# Altium project AS5600.PrjPcb
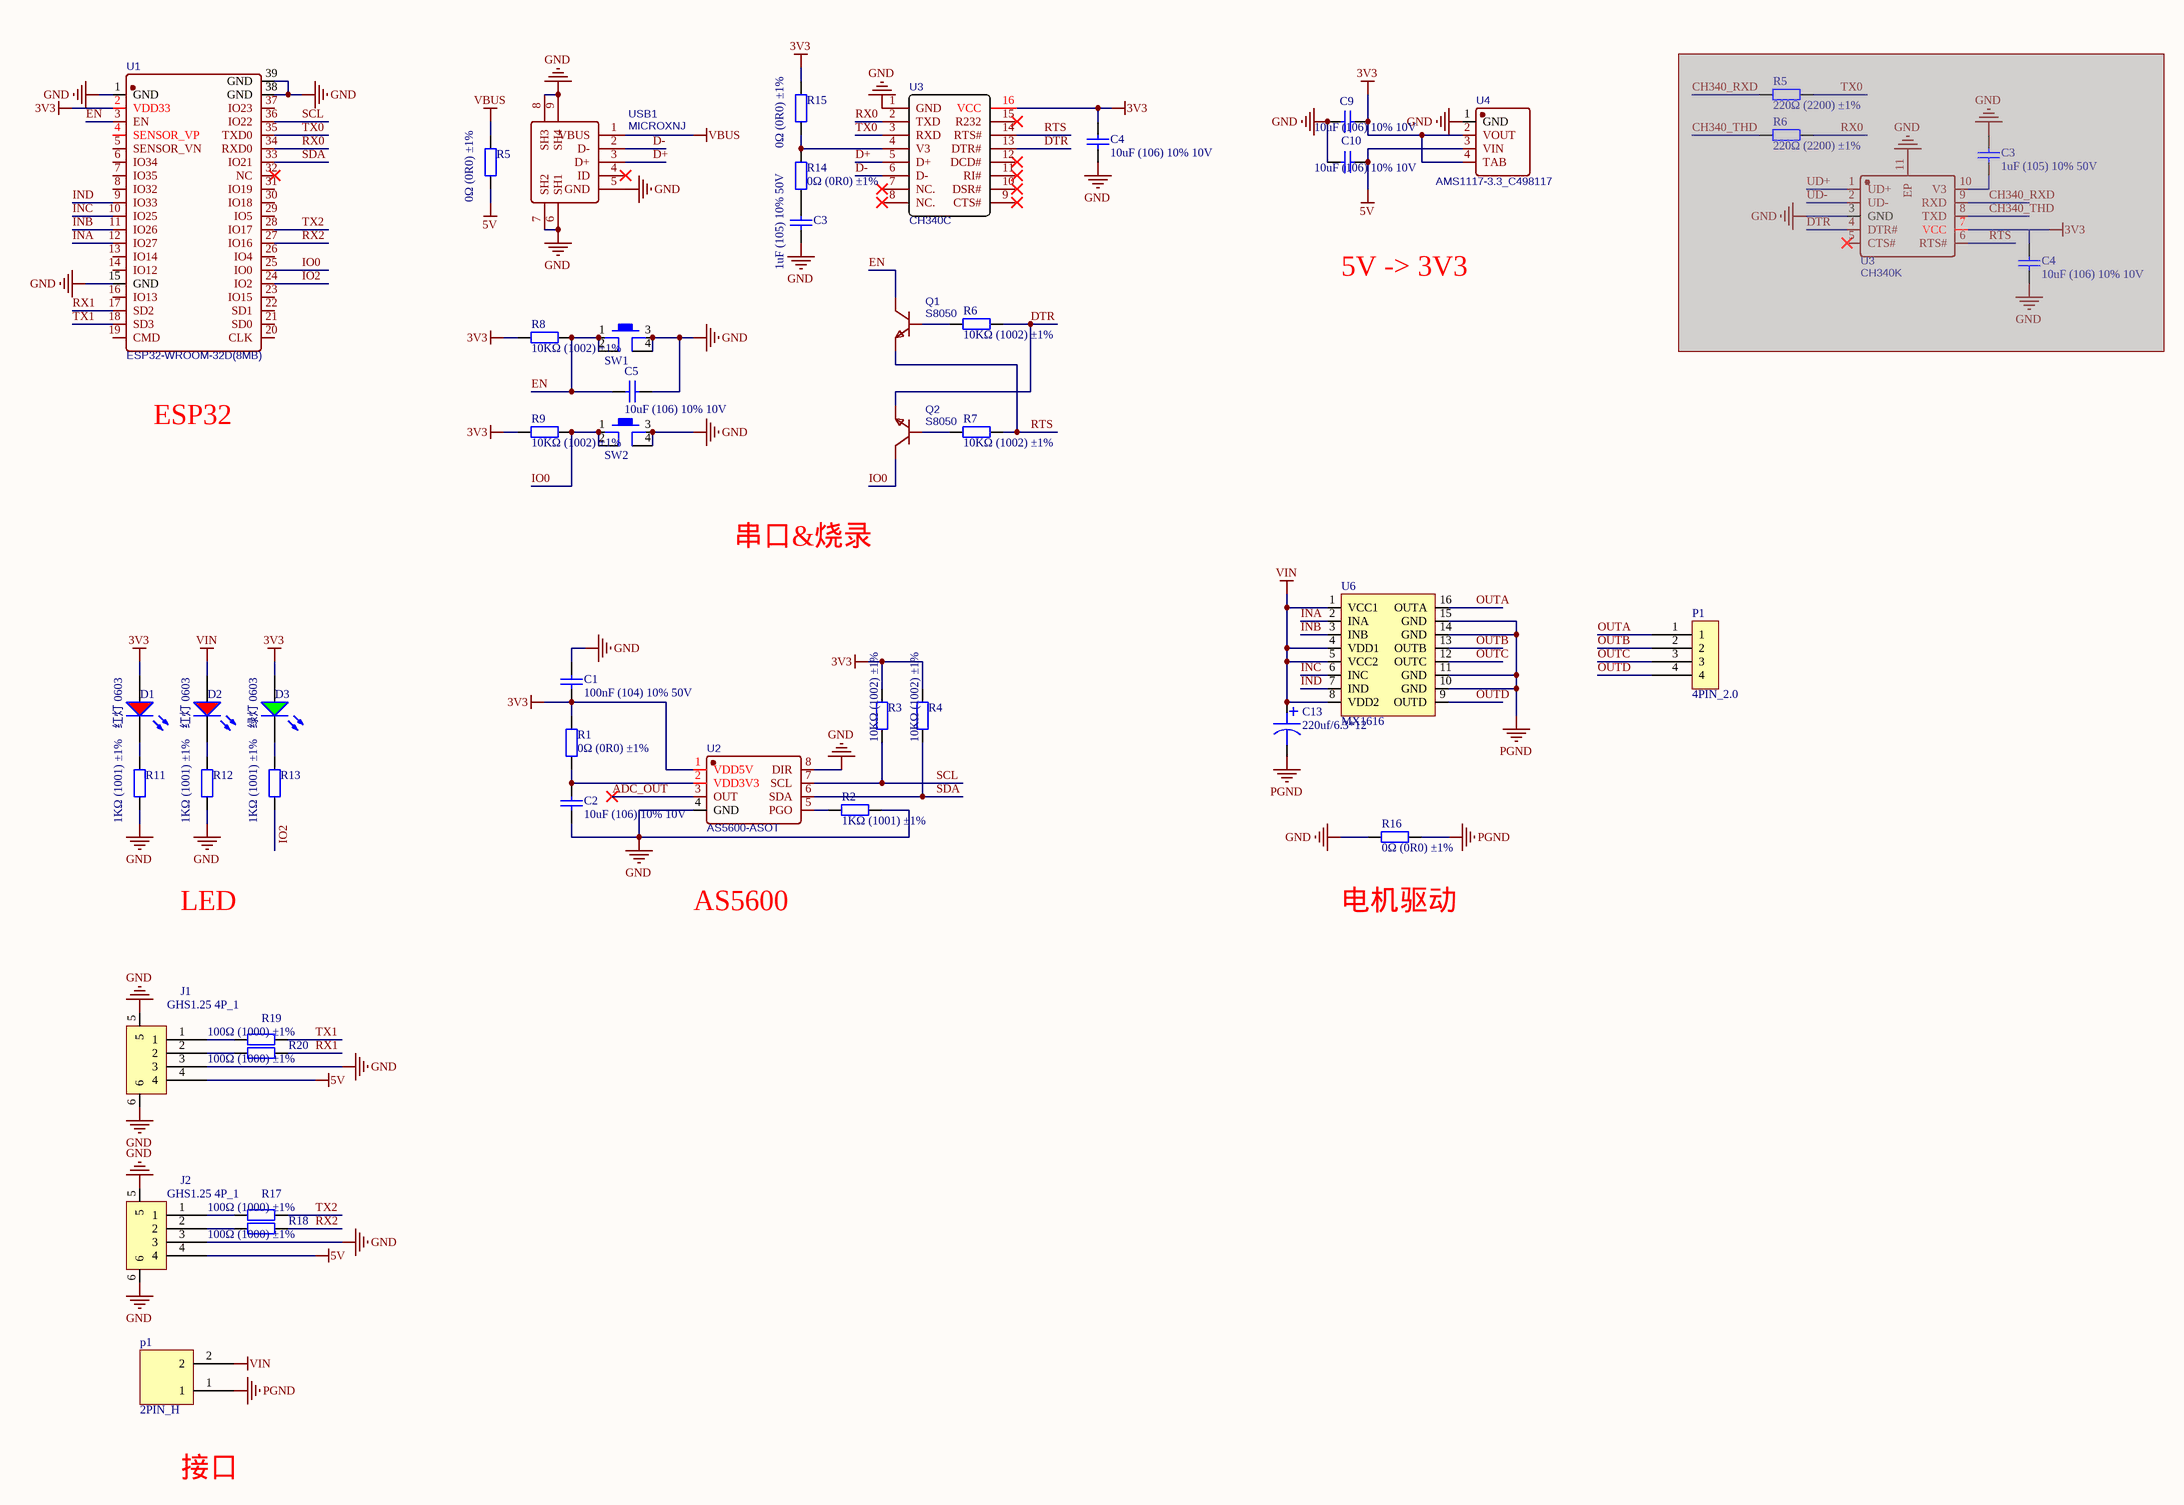
[diagram p0: AS5600.SchDoc]
1 sheet, 49 parts. Net scope: global (net labels, ports and power ports of the same name join across sheets).
Board file: AS5600.PcbDoc

## Sheet AS5600.SchDoc
size A2

### Parts
(Parts that share a designator on the sheet are numbered #1, #2 ... from top to bottom, then left to right.)
C1  100nF (104) 10% 50V  [0603_C]
C2  10uF (106) 10% 10V  [0603_C]
C3#1  1uF (105) 10% 50V  [0603_C]  (masked out: inside a compile mask, not in the netlist)
C3#2  1uF (105) 10% 50V  [0603_C]
C4#1  10uF (106) 10% 10V  [0603_C]
C4#2  10uF (106) 10% 10V  [0603_C]  (masked out: inside a compile mask, not in the netlist)
C5  10uF (106) 10% 10V  [0603_C]
C9  10uF (106) 10% 10V  [0603_C]
C10  10uF (106) 10% 10V  [0603_C]
C13  220uf/6.3*12  [220UF_25V]
D1  红灯 0603  [0603_LED_S1]
D2  红灯 0603  [0603_LED_S1]
D3  绿灯 0603  [0603_LED_S1]
J1  GHS1.25 4P_1  [SM04B-GHS卧式]
J2  GHS1.25 4P_1  [SM04B-GHS卧式]
P1#1  4PIN_2.0  [4PIN_2MM]
p1#2  2PIN_H  [CONN-TH_XH-2A]
Q1  S8050  [S8050]
Q2  S8050  [S8050]
R1  0Ω (0R0) ±1%  [0603_R]
R2  1KΩ (1001) ±1%  [0603_R]
R3  10KΩ (1002) ±1%  [0603_R]
R4  10KΩ (1002) ±1%  [0603_R]
R5#1  220Ω (2200) ±1%  [0603_R]  (masked out: inside a compile mask, not in the netlist)
R5#2  0Ω (0R0) ±1%  [0603_R]
R6#1  220Ω (2200) ±1%  [0603_R]  (masked out: inside a compile mask, not in the netlist)
R6#2  10KΩ (1002) ±1%  [0603_R]
R7  10KΩ (1002) ±1%  [0603_R]
R8  10KΩ (1002) ±1%  [0603_R]
R9  10KΩ (1002) ±1%  [0603_R]
R11  1KΩ (1001) ±1%  [0603_R]
R12  1KΩ (1001) ±1%  [0603_R]
R13  1KΩ (1001) ±1%  [0603_R]
R14  0Ω (0R0) ±1%  [0603_R]
R15  0Ω (0R0) ±1%  [0603_R]
R16  0Ω (0R0) ±1%  [0603_R]
R17  100Ω (1000) ±1%  [0603_R]
R18  100Ω (1000) ±1%  [0603_R]
R19  100Ω (1000) ±1%  [0603_R]
R20  100Ω (1000) ±1%  [0603_R]
SW1  按键开关  [SW_SMD_4P_2]  (value not drawn)
SW2  按键开关  [SW_SMD_4P_2]  (value not drawn)
U1  ESP32-WROOM-32D(8MB)  [ESP-WROOM-32D]
U2  AS5600-ASOT  [AS5600-ASOT]
U3#1  CH340C  [CH340C]
U3#2  CH340K  [CH340K]  (masked out: inside a compile mask, not in the netlist)
U4  AMS1117-3.3_C498117  [PG-SOT223-4_L6.5-W3.5-P2.30-LS7.0-BR]
U6  MX1616  [MX1616]
USB1  MICROXNJ  [MICRO-USB-SMD_MICROXNJ]

### Nets
3V3: C1.1 C4#1.2 C9.2 D1.A D3.A R1.2 R3.2 R4.2 R8.1 R9.1 R15.1 U1.2(VDD33) U2.1(VDD5V) U3#1.16(VCC) U4.2(VOUT) U4.4(TAB)
5V: C10.2 J1.4 J2.4 R5#2.2 U4.3(VIN)
GND: C1.2 C2.1 C3#2.1 C4#1.1 C5.2 C9.1 C10.1 J1.3 J1.5 J1.6 J2.3 J2.5 J2.6 R2.2 R11.2 R12.2 R16.1 SW1.3 SW1.4 SW2.3 SW2.4 U1.1(GND) U1.15(GND) U1.38(GND) U1.39(GND) U2.4(GND) U2.8(DIR) U3#1.1(GND) U4.1(GND) USB1.5(GND) USB1.6(SH1) USB1.7(SH2) USB1.8(SH3) USB1.9(SH4)
PGND: C13.2 p1#2.1 R16.2 U6.10(GND) U6.11(GND) U6.14(GND) U6.15(GND)
VBUS: R5#2.1 USB1.1(VBUS)
VIN: C13.1 D2.A p1#2.2 U6.1(VCC1) U6.4(VDD1) U6.5(VCC2) U6.8(VDD2)
ADC_OUT: U2.3(OUT)
D+: U3#1.5(D+) USB1.3(D+)
D-: U3#1.6(D-) USB1.2(D-)
DTR: Q2.2(E) R6#2.2 U3#1.13(DTR#)
EN: C5.1 Q1.3(C) R8.2 SW1.1 SW1.2 U1.3(EN)
INA: U1.12(IO27) U6.2(INA)
INB: U1.11(IO26) U6.3(INB)
INC: U1.10(IO25) U6.6(INC)
IND: U1.9(IO33) U6.7(IND)
IO0: Q2.3(C) R9.2 SW2.1 SW2.2 U1.25(IO0)
IO2: R13.2 U1.24(IO2)
OUTA: P1#1.1 U6.16(OUTA)
OUTB: P1#1.2 U6.13(OUTB)
OUTC: P1#1.3 U6.12(OUTC)
OUTD: P1#1.4 U6.9(OUTD)
RTS: Q1.2(E) R7.2 U3#1.14(RTS#)
RX0: U1.34(RXD0) U3#1.2(TXD)
RX1: R20.2 U1.17(SD2)
RX2: R18.2 U1.27(IO16)
SCL: R3.1 U1.36(IO22) U2.7(SCL)
SDA: R4.1 U1.33(IO21) U2.6(SDA)
TX0: U1.35(TXD0) U3#1.3(RXD)
TX1: R19.2 U1.18(SD3)
TX2: R17.2 U1.28(IO17)
NetC2_2: C2.2 R1.1 U2.2(VDD3V3)
NetC3#2_2: C3#2.2 R14.2
NetD1_K: D1.K R11.1
NetD2_K: D2.K R12.1
NetD3_K: D3.K R13.1
NetJ1_1: J1.1 R19.1
NetJ1_2: J1.2 R20.1
NetJ2_1: J2.1 R17.1
NetJ2_2: J2.2 R18.1
NetQ1_1: Q1.1(B) R6#2.1
NetQ2_1: Q2.1(B) R7.1
NetR2_1: R2.1 U2.5(PGO)
NetR14_1: R14.1 R15.2 U3#1.4(V3)

Not connected (* = marked no-connect by the designer): U1 4(SENSOR_VP) 5(SENSOR_VN) 6(IO34) 7(IO35) 8(IO32) 13(IO14) 14(IO12) 16(IO13) 19(CMD) 20(CLK) 21(SD0) 22(SD1) 23(IO15) 26(IO4) 29(IO5) 30(IO18) 31(IO19) 32(NC)* 37(IO23); U3#1 7(NC.)* 8(NC.)* 9(CTS#)* 10(DSR#)* 11(RI#)* 12(DCD#)* 15(R232)*; USB1 4(ID)*

### Notes on the sheet
- 5V -> 3V3
- ESP32
- 串口&烧录
- LED
- AS5600
- (near R16) 电机驱动
- 接口

### Library data of the parts
C1 = 0603 100nF (104) 10% 50V: 贴片电容; ComponentLink1Description: 供应商链接; ComponentLink1URL: http://www.szlcsc.com/product/details_15331.html; Package: 0603; Supplier: LC; SuppliersPartNumber: C14663
C2 C4#1 C4#2 C5 C9 C10 = 0603 10uF (106) 10% 10V: 贴片电容; ComponentLink1Description: 供应商链接; ComponentLink1URL: http://www.szlcsc.com/product/details_20411.html; Package: 0603; Supplier: LC; SuppliersPartNumber: C19702
C3#1 C3#2 = 0603 1uF (105) 10% 50V: 贴片电容; ComponentLink1Description: 供应商链接; ComponentLink1URL: http://www.szlcsc.com/product/details_16531.html; Package: 0603; Supplier: LC; SuppliersPartNumber: C15849
C13 = 220uf 25Vv
D1 D2 = 0603 红灯: 发光二极管; ComponentLink1Description: 供应商链接; ComponentLink1URL: http://www.szlcsc.com/product/details_2659.html; Package: 0603; Supplier: LC; SuppliersPartNumber: C2286
D3 = 0603 绿灯: 发光二极管; ComponentLink1Description: 供应商链接; ComponentLink1URL: http://www.szlcsc.com/product/details_73152.html; Package: 0603; Supplier: LC; SuppliersPartNumber: C72043
J1 J2 = GHS1.25 4P_1: 卧式
Q1 Q2 = S8050_C2894711: BOM_Manufacturer: PUOLOP(迪浦); Contributor: LCSC; BOM_Supplier: LCSC; BOM_Supplier Part: C2894711; BOM_Manufacturer Part: S8050; spicePre: Q; spiceSymbolName: S8050_C2894711
R1 R5#2 R14-R16 = 0603 0Ω (0R0) 1%: 贴片电阻; ComponentLink1Description: 供应商链接; ComponentLink1URL: http://www.szlcsc.com/product/details_21903.html; Package: 0603; Supplier: LC; SuppliersPartNumber: C21189
R2 R11-R13 = 0603 1KΩ (1001) 1%: 贴片电阻; ComponentLink1Description: 供应商链接; ComponentLink1URL: http://www.szlcsc.com/product/details_21904.html; Package: 0603; Supplier: LC; SuppliersPartNumber: C21190
R3 R4 R6#2 R7-R9 = 0603 10KΩ (1002) 1%: 贴片电阻; ComponentLink1Description: 供应商链接; ComponentLink1URL: http://www.szlcsc.com/product/details_26547.html; Package: 0603; Supplier: LC; SuppliersPartNumber: C25804
R5#1 R6#1 = 0603 220Ω (2200) 1%: 贴片电阻; ComponentLink1Description: 供应商链接; ComponentLink1URL: http://www.szlcsc.com/product/details_23689.html; Package: 0603; Supplier: LC; SuppliersPartNumber: C22962
R17-R20 = 0603 100Ω (1000) 1%: 贴片电阻; ComponentLink1Description: 供应商链接; ComponentLink1URL: http://www.szlcsc.com/product/details_23502.html; Package: 0603; Supplier: LC; SuppliersPartNumber: C22775
SW1 SW2 = SW_SMD_4P
U1 = ESP32-WROOM-32D(8MB): BOM_Manufacturer: Espressif Systems; Contributor: LCSC; BOM_Supplier: LCSC; BOM_Supplier Part: C529577; BOM_Manufacturer Part: ESP32-WROOM-32D(8MB); BOM_JLCPCB Part Class: Extended Part; spicePre: U; spiceSymbolName: ESP32-WROOM-32D(8MB)
U2 = AS5600-ASOT: BOM_Manufacturer: Advanced Monolithic Systems; Contributor: LCSC; BOM_Supplier: LCSC; BOM_Supplier Part: C499458; BOM_Manufacturer Part: AS5600-ASOT; BOM_JLCPCB Part Class: Extended Part; spicePre: U; spiceSymbolName: AS5600-ASOT
U3#1 = CH340C: BOM_Manufacturer: WCH; BOM_Supplier: LCSC; BOM_Manufacturer Part: CH340C; BOM_Supplier Part: C84681; BOM_JLCPCB Part Class: Extended Part; spicePre: U; spiceSymbolName: CH340C
U3#2 = CH340K: BOM_Manufacturer: WCH(Jiangsu Qin Heng); Contributor: LCSC; BOM_Supplier: LCSC; BOM_Supplier Part: C968586; BOM_Manufacturer Part: CH340K; BOM_JLCPCB Part Class: Extended Part; spicePre: U; spiceSymbolName: CH340K
U4 = AMS1117-3.3_C498117: BOM_Manufacturer: HGC(Huaguan Semicon); Contributor: LCSC; BOM_Supplier: LCSC; BOM_Supplier Part: C498117; BOM_Manufacturer Part: AMS1117-3.3; BOM_JLCPCB Part Class: Extended Part; spicePre: U; spiceSymbolName: AMS1117-3.3_C498117
USB1 = MICROXNJ: BOM_Manufacturer: SHOU HAN; Contributor: LCSC; BOM_Supplier: LCSC; BOM_Supplier Part: C404969; BOM_Manufacturer Part: MicroXNJ; BOM_JLCPCB Part Class: Extended Part; spicePre: U; spiceSymbolName: MICROXNJ